# Altium schematic sheet [02] Top.SchDoc: Top schematic
size A3; Engineer: M. Folejewski; DocumentNumber: 2; SheetNumber: 2; SheetTotal: 4; PageSize: A3; Designators: 1-99
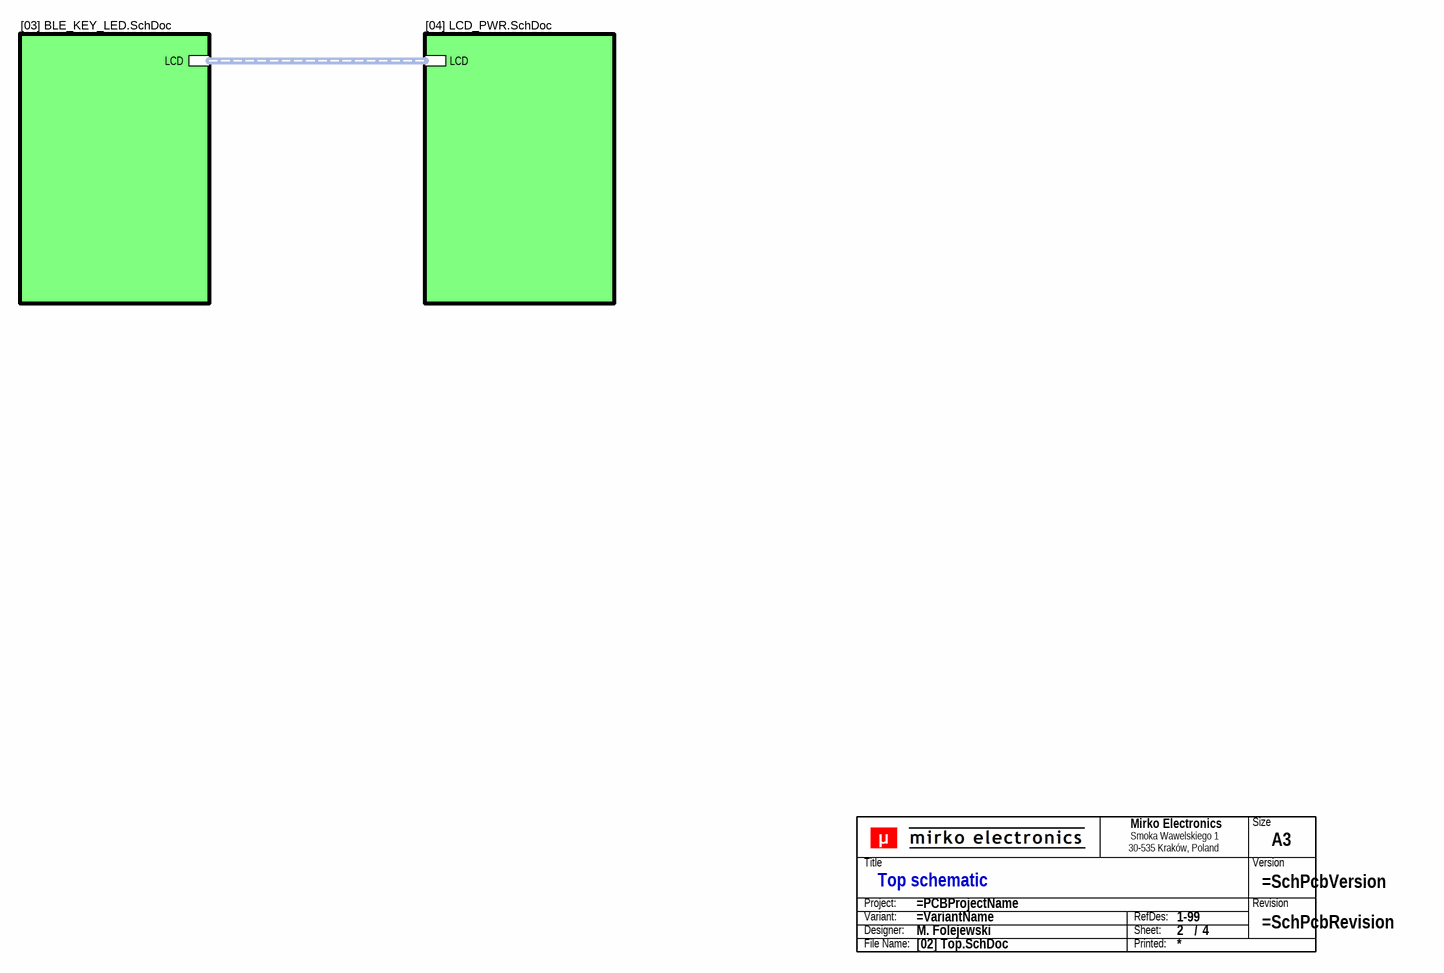
[diagram p0: [02] Top.SchDoc]

## Parts
TB?  Title block  (value not drawn)  (graphical)

## Sub-sheets
D7 = [03] BLE_KEY_LED.SchDoc: LCD (harness LCD)
D8 = [04] LCD_PWR.SchDoc: LCD (harness LCD)

## Buses and harness runs
harness sheet D7/LCD = sheet D8/LCD

## Notes on the sheet
- (in symbol SCH_TITLE_BLOCK_V1) Mirko Electronics; Size; Smoka Wawelskiego 1; 30-535 Kraków, Poland; Title; Version; Project:; Revision; Variant:; RefDes:; Designer:; Sheet:; /; File Name:; Printed:

## Library data of the parts
TB? = SCH_TITLE_BLOCK_V1: Component Type: Title block; Manufacturer: -; Mounting Type: Non component; MPN: -; Operating Temperature: -; Package: -; Specification: Title block; Value: Title block; Replacement: -; System: ?